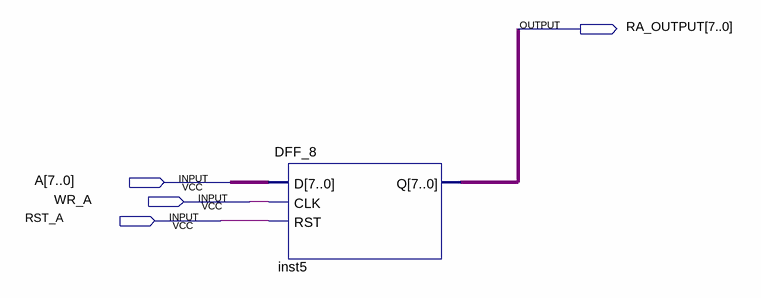
[diagram p0: schematic sheet]
// Quartus schematic Calculator_Path.bdf as structural Verilog: 1 symbols, 4 pins
module Calculator_Path (
  input  [7:0] A,
  input  WR_A,
  input  RST_A,
  output [7:0] RA_OUTPUT
);

  DFF_8 inst5 (.D(A), .CLK(WR_A), .RST(RST_A), .Q(RA_OUTPUT));
endmodule
